# Altium project PCB_Project.PrjPcb
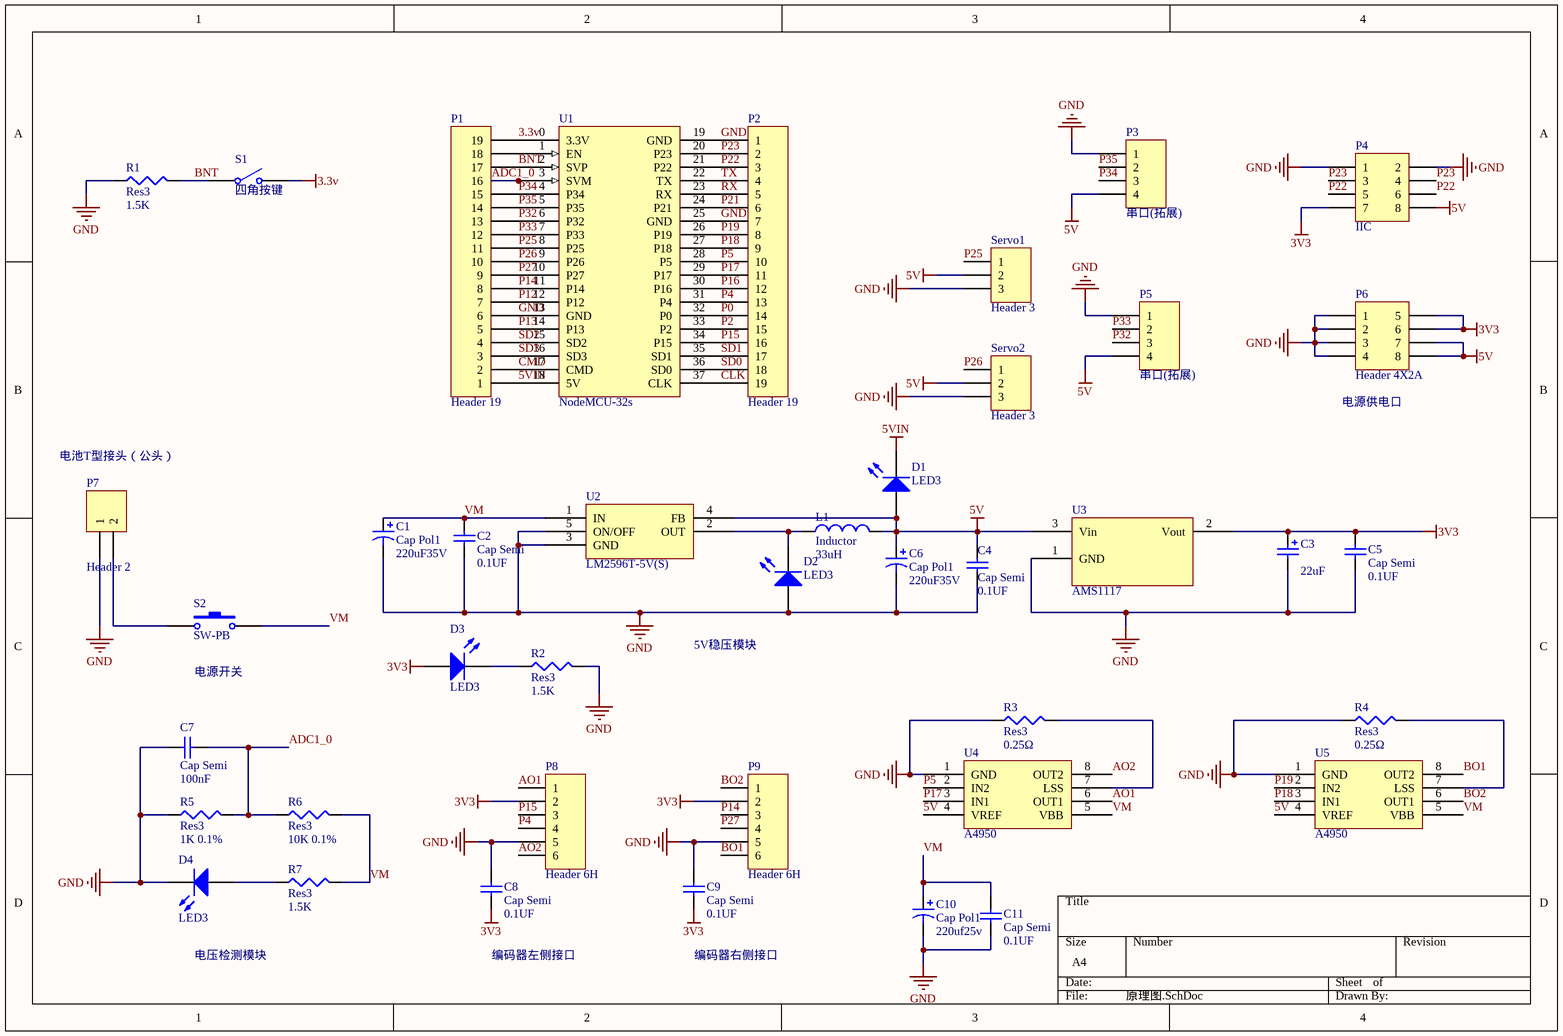
[diagram p0: 原理图.SchDoc]
1 sheet, 41 parts. Net scope: global (net labels, ports and power ports of the same name join across sheets).
Board file: 五菱宏光.PcbDoc

## Sheet 原理图.SchDoc
size A4

### Parts
C1  Cap Pol1  value 220uF35V  [CAPM8485X103N]
C2  Cap Semi  value 0.1UF  [C1210]
C3  value 22uF  [CAPMP6022X29N]
C4  Cap Semi  value 0.1UF  [C1210]
C5  Cap Semi  value 0.1UF  [C1210]
C6  Cap Pol1  value 220uF35V  [CAPM8485X103N]
C7  Cap Semi  value 100nF  [C1210]
C8  Cap Semi  value 0.1UF  [C1210]
C9  Cap Semi  value 0.1UF  [C1210]
C10  Cap Pol1  value 220uf25v  [RB7.6]
C11  Cap Semi  value 0.1UF  [C1210]
D1  LED3  [3.5X2.8X1.9]
D2  LED3  [3.5X2.8X1.9]
D3  LED3  [3.5X2.8X1.9]
D4  LED3  [3.5X2.8X1.9]
L1  Inductor  value 33uH  [CAPM100100X103N]
P1  Header 19  [HDR1X19]
P2  Header 19  [HDR1X19]
P3  串口(拓展)  [HDR1X4]
P4  IIC  [HDR2X4]
P5  串口(拓展)  [HDR1X4]
P6  Header 4X2A  [HDR2X4_CEN]
P7  Header 2  [RH-7104]
P8  Header 6H  [HDR1X6H]
P9  Header 6H  [HDR1X6H]
R1  Res3  value 1.5K  [14-1210]
R2  Res3  value 1.5K  [14-1210]
R3  Res3  value 0.25Ω  [12Z-2010]
R4  Res3  value 0.25Ω  [12Z-2010]
R5  Res3  value 1K 0.1%  [14-1210]
R6  Res3  value 10K 0.1%  [14-1210]
R7  Res3  value 1.5K  [14-1210]
S1  四角按键  [sw-4-Pin]
S2  SW-PB  [开关]
Servo1  Header 3  [HDR1X3]
Servo2  Header 3  [HDR1X3]
U1  NodeMCU-32s  [NodeMCU_ESP32]
U2  LM2596T-5V(S)  [DPAK170P1534X450-6N]
U3  AMS1117  [DPAK230P700X180-4N]
U4  A4950  [SOP8]
U5  A4950  [SOP8]

### Nets
3.3v: P1.19 S1.2(NO) U1.0(3.3V)
3V3: C3.1 C5.2 C8.1 C9.1 D3.1(A) P4.7 P6.5 P6.6 P8.2 P9.2 U3.2(Vout)
5V: C4.2 C6.1 D1.1(A) L1.2 P3.4 P4.8 P5.4 P6.7 P6.8 Servo1.2 Servo2.2 U2.4(FB) U3.3(Vin) U4.4(VREF) U5.4(VREF)
5VIN: D1.2(K) P1.1 U1.18(5V)
GND: C1.2 C2.1 C3.2 C4.1 C5.1 C6.2 C7.1 C8.2 C9.2 C10.2 C11.1 D2.1(A) D4.2(K) P1.6 P2.1 P2.7 P3.1 P4.1 P4.2 P5.1 P6.1 P6.2 P6.3 P6.4 P7.1 P8.5 P9.5 R1.1 R2.2 R3.1 R4.1 R5.1 Servo1.3 Servo2.3 U1.13(GND) U1.19(GND) U1.25(GND) U2.3(GND) U2.5(ON/OFF) U3.1(GND) U4.1(GND) U5.1(GND)
ADC1_0: C7.2 P1.16 R5.2 R6.1 U1.3(SVM)
AO1: P8.1 U4.6(OUT1)
AO2: P8.6 U4.8(OUT2)
BNT: P1.17 R1.2 S1.1(COMMON) U1.2(SVP)
BO1: P9.6 U5.8(OUT2)
BO2: P9.1 U5.6(OUT1)
CLK: P2.19 U1.37(CLK)
CMD: P1.2 U1.17(CMD)
P0: P2.14 U1.32(P0)
P2: P2.15 U1.33(P2)
P4: P2.13 P8.4 U1.31(P4)
P5: P2.10 U1.28(P5) U4.2(IN2)
P12: P1.7 U1.12(P12)
P13: P1.5 U1.14(P13)
P14: P1.8 P9.3 U1.11(P14)
P15: P2.16 P8.3 U1.34(P15)
P16: P2.12 U1.30(P16)
P17: P2.11 U1.29(P17) U4.3(IN1)
P18: P2.9 U1.27(P18) U5.3(IN1)
P19: P2.8 U1.26(P19) U5.2(IN2)
P21: P2.6 U1.24(P21)
P22: P2.3 P4.5 P4.6 U1.21(P22)
P23: P2.2 P4.3 P4.4 U1.20(P23)
P25: P1.11 Servo1.1 U1.8(P25)
P26: P1.10 Servo2.1 U1.9(P26)
P27: P1.9 P9.4 U1.10(P27)
P32: P1.13 P5.3 U1.6(P32)
P33: P1.12 P5.2 U1.7(P33)
P34: P1.15 P3.3 U1.4(P34)
P35: P1.14 P3.2 U1.5(P35)
RX: P2.5 U1.23(RX)
SD0: P2.18 U1.36(SD0)
SD1: P2.17 U1.35(SD1)
SD2: P1.4 U1.15(SD2)
SD3: P1.3 U1.16(SD3)
TX: P2.4 U1.22(TX)
VM: C1.1 C2.2 C10.1 C11.2 R6.2 R7.2 S2.2 U2.1(IN) U4.5(VBB) U5.5(VBB)
NetD2_2: D2.2(K) L1.1 U2.2(OUT)
NetD3_2: D3.2(K) R2.1
NetD4_1: D4.1(A) R7.1
NetP1_18: P1.18 U1.1(EN)
NetP7_2: P7.2 S2.1
NetR3_2: R3.2 U4.7(LSS)
NetR4_2: R4.2 U5.7(LSS)

### Notes on the sheet
- (near P6) 电源供电口
- 电池T型接头（公头）
- 5V稳压模块
- (near S2) 电源开关
- 电压检测模块
- 编码器左侧接口
- 编码器右侧接口

### Library data of the parts
C1 C6 C10 = Cap Pol1: Polarized Capacitor (Radial); Published: 8-Jun-2000; LatestRevisionDate: 17-Jul-2002; LatestRevisionNote: Re-released for DXP Platform.; PackageReference: RB7.6-15; Publisher: Altium Limited; PackageDescription: Polarized Capacitor (Radial); 2 Leads
C2 C4 C5 C7-C9 C11 = Cap Semi: Capacitor (Semiconductor SIM Model); Published: 8-Jun-2000; LatestRevisionDate: 29-May-2009; LatestRevisionNote: IPC-7351 Footprint Added.; PackageReference: C1206; Publisher: Altium Limited; PackageDescription: Chip Capacitor
C3 = Cap Pol2: Polarized Capacitor (Axial); Published: 8-Jun-2000; LatestRevisionDate: 17-Jul-2002; LatestRevisionNote: Re-released for DXP Platform.; PackageReference: POLAR0.8; Publisher: Altium Limited; PackageDescription: Polarized Capacitor; 2 Leads
D1-D4 = LED3: Typical BLUE SiC LED; Published: 8-Jun-2000; LatestRevisionDate: 17-Dec-2003; LatestRevisionNote: PCB Footprint replaced.; DatasheetVersion: 16-Apr-2002; PackageVersion: 16-Apr-2002; PackageReference: 3.5X2.8X1.9; Publisher: Altium Limited; PackageDescription: SM LED; 2 C-Bend Leads; Body 3.5 x 2.8 x 1.9 mm, inc leads (LxWxH typ)
L1 = Inductor: Code_IEC: 1005; Published: 8-Jun-2000; LatestRevisionDate: 29-May-2009; LatestRevisionNote: IPC-7351 Footprint Added.; PackageReference: 0402-A; Publisher: Altium Limited; PackageDescription: Chip Inductor; Code_JEITA: 0402
P1 P2 = Header 19: Header, 19-Pin; LatestRevisionDate: 17-Jul-2002; LatestRevisionNote: Re-released for DXP Platform.; Publisher: Altium Limited
P3 P5 = Header 4: Header, 4-Pin; LatestRevisionDate: 17-Jul-2002; LatestRevisionNote: Re-released for DXP Platform.; Publisher: Altium Limited
P4 = Header 4X2: Header, 4-Pin, Dual row; LatestRevisionDate: 17-Jul-2002; LatestRevisionNote: Re-released for DXP Platform.; Publisher: Altium Limited
P6 = Header 4X2A: Header, 4-Pin, Dual row; LatestRevisionDate: 17-Jul-2002; LatestRevisionNote: Re-released for DXP Platform.; Publisher: Altium Limited
P7 = Header 2: Header, 2-Pin; LatestRevisionDate: 17-Jul-2002; LatestRevisionNote: Re-released for DXP Platform.; Publisher: Altium Limited
P8 P9 = Header 6H: Header, 6-Pin, Right Angle; LatestRevisionDate: 17-Jul-2002; LatestRevisionNote: Re-released for DXP Platform.; Publisher: Altium Limited
R1-R7 = Res3: Resistor; Published: 8-Jun-2000; LatestRevisionDate: 29-May-2009; LatestRevisionNote: IPC-7351 Footprint Added.; PackageReference: J1-0603; Publisher: Altium Limited; PackageDescription: Chip Resistor
S1 = SW-SPST: Single-Pole, Single-Throw Switch; Published: 24-Mar-1999; LatestRevisionDate: 17-Jul-2002; LatestRevisionNote: Re-released for DXP Platform.; PackageReference: SPST-2; Publisher: Altium Limited; PackageDescription: Switch; 2 Leads
S2 = SW-PB: Switch; Published: 24-Mar-1999; LatestRevisionDate: 17-Jul-2002; LatestRevisionNote: Re-released for DXP Platform.; PackageReference: SPST-2; Publisher: Altium Limited; PackageDescription: Switch; 2 Leads
Servo1 Servo2 = Header 3: Header, 3-Pin; LatestRevisionDate: 17-Jul-2002; LatestRevisionNote: Re-released for DXP Platform.; Publisher: Altium Limited